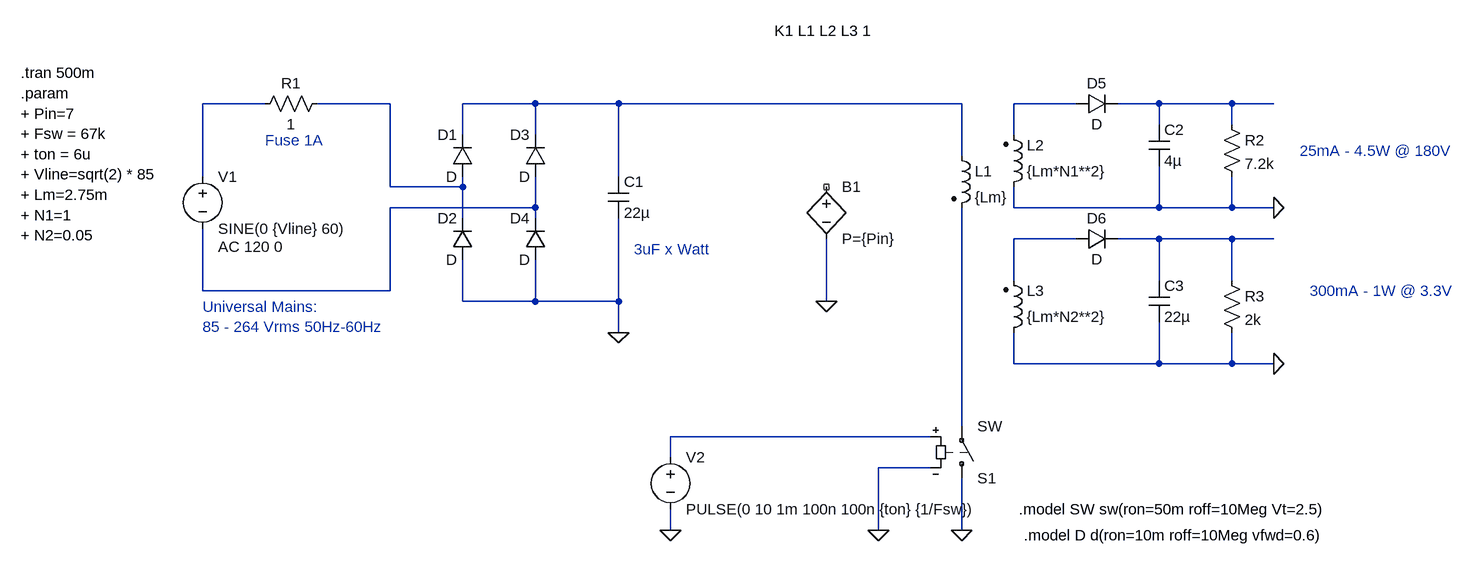
[diagram p0: schematic nixie_ac_dc_power.asc]
nixie_ac_dc_power.asc, the LTspice schematic file:
Version 4
SHEET 1 2016 680
WIRE 176 0 80 0
WIRE 368 0 256 0
WIRE 592 0 480 0
WIRE 720 0 592 0
WIRE 1248 0 720 0
WIRE 1424 0 1328 0
WIRE 1552 0 1488 0
WIRE 1664 0 1552 0
WIRE 1728 0 1664 0
WIRE 1552 32 1552 0
WIRE 1664 32 1664 0
WIRE 480 48 480 0
WIRE 592 48 592 0
WIRE 1328 48 1328 0
WIRE 1248 80 1248 0
WIRE 80 112 80 0
WIRE 720 112 720 0
WIRE 368 128 368 0
WIRE 480 128 480 112
WIRE 480 128 368 128
WIRE 592 160 592 112
WIRE 592 160 368 160
WIRE 1328 160 1328 128
WIRE 1552 160 1552 96
WIRE 1552 160 1328 160
WIRE 1664 160 1664 112
WIRE 1664 160 1552 160
WIRE 1728 160 1664 160
WIRE 480 176 480 128
WIRE 592 176 592 160
WIRE 1424 208 1328 208
WIRE 1552 208 1488 208
WIRE 1664 208 1552 208
WIRE 1728 208 1664 208
WIRE 1328 272 1328 208
WIRE 1552 272 1552 208
WIRE 1664 272 1664 208
WIRE 80 288 80 192
WIRE 368 288 368 160
WIRE 368 288 80 288
WIRE 480 304 480 240
WIRE 592 304 592 240
WIRE 592 304 480 304
WIRE 720 304 720 176
WIRE 720 304 592 304
WIRE 1040 304 1040 208
WIRE 720 352 720 304
WIRE 1328 400 1328 352
WIRE 1552 400 1552 336
WIRE 1552 400 1328 400
WIRE 1664 400 1664 352
WIRE 1664 400 1552 400
WIRE 1728 400 1664 400
WIRE 1248 496 1248 160
WIRE 1200 512 800 512
WIRE 800 544 800 512
WIRE 1200 560 1120 560
WIRE 800 656 800 624
WIRE 1120 656 1120 560
WIRE 1248 656 1248 576
FLAG 720 352 0
FLAG 1040 304 0
FLAG 1248 656 0
FLAG 1120 656 0
FLAG 800 656 0
FLAG 1728 400 0
FLAG 1728 160 0
SYMBOL voltage 80 96 R0
WINDOW 123 24 124 Left 2
WINDOW 39 0 0 Left 0
SYMATTR Value2 AC 120 0
SYMATTR InstName V1
SYMATTR Value SINE(0 {Vline} 60)
SYMBOL diode 496 112 R180
WINDOW 0 24 64 Left 2
WINDOW 3 24 0 Left 2
SYMATTR InstName D1
SYMBOL diode 496 240 R180
WINDOW 0 24 64 Left 2
WINDOW 3 24 0 Left 2
SYMATTR InstName D2
SYMBOL diode 608 112 R180
WINDOW 0 24 64 Left 2
WINDOW 3 24 0 Left 2
SYMATTR InstName D3
SYMBOL diode 608 240 R180
WINDOW 0 24 64 Left 2
WINDOW 3 24 0 Left 2
SYMATTR InstName D4
SYMBOL cap 704 112 R0
SYMATTR InstName C1
SYMATTR Value 22µ
SYMATTR SpiceLine Rser=10m
SYMBOL bv 1040 112 R0
SYMATTR InstName B1
SYMATTR Value P={Pin}
SYMBOL res 272 -16 R90
WINDOW 0 0 56 VBottom 2
WINDOW 3 32 56 VTop 2
SYMATTR InstName R1
SYMATTR Value 1
SYMBOL ind2 1232 64 R0
SYMATTR InstName L1
SYMATTR Value {Lm}
SYMATTR Type ind
SYMBOL ind2 1312 144 M180
WINDOW 0 36 80 Left 2
WINDOW 3 36 40 Left 2
SYMATTR InstName L2
SYMATTR Value {Lm*N1**2}
SYMATTR Type ind
SYMBOL ind2 1312 368 M180
WINDOW 0 36 80 Left 2
WINDOW 3 36 40 Left 2
SYMATTR InstName L3
SYMATTR Value {Lm*N2**2}
SYMATTR Type ind
SYMBOL diode 1424 16 R270
WINDOW 0 32 32 VTop 2
WINDOW 3 0 32 VBottom 2
SYMATTR InstName D5
SYMBOL diode 1424 224 R270
WINDOW 0 32 32 VTop 2
WINDOW 3 0 32 VBottom 2
SYMATTR InstName D6
SYMBOL cap 1536 32 R0
SYMATTR InstName C2
SYMATTR Value 4µ
SYMATTR SpiceLine Rser=10m
SYMBOL cap 1536 272 R0
SYMATTR InstName C3
SYMATTR Value 22µ
SYMATTR SpiceLine Rser=10m
SYMBOL sw 1248 592 M180
SYMATTR InstName S1
SYMBOL voltage 800 528 R0
WINDOW 123 0 0 Left 0
WINDOW 39 0 0 Left 0
SYMATTR InstName V2
SYMATTR Value PULSE(0 10 1m 100n 100n {ton} {1/Fsw})
SYMBOL res 1648 16 R0
SYMATTR InstName R2
SYMATTR Value 7.2k
SYMBOL res 1648 256 R0
SYMATTR InstName R3
SYMATTR Value 2k
TEXT -200 -48 Left 2 !.tran 500m
TEXT -200 -16 Left 2 !.param \n+ Pin=7 \n+ Fsw = 67k\n+ ton = 6u\n+ Vline=sqrt(2) * 85\n+ Lm=2.75m\n+ N1=1 \n+ N2=0.05
TEXT 80 312 Left 2 ;Universal Mains: \n85 - 264 Vrms 50Hz-60Hz
TEXT 176 56 Left 2 ;Fuse 1A
TEXT 960 -112 Left 2 !K1 L1 L2 L3 1
TEXT 1336 624 Left 2 !.model SW sw(ron=50m roff=10Meg Vt=2.5)
TEXT 1344 664 Left 2 !.model D d(ron=10m roff=10Meg vfwd=0.6)
TEXT 744 224 Left 2 ;3uF x Watt
TEXT 1768 72 Left 2 ;25mA - 4.5W @ 180V
TEXT 1784 288 Left 2 ;300mA - 1W @ 3.3V

The netlist it stands for:
* nixie_ac_dc_power.asc
V1 N001 N006 SINE(0 {Vline} 60) AC 120 0
D1 N002 N003 D
D2 0 N002 D
D3 N006 N003 D
D4 0 N006 D
C1 N003 0 22µ Rser=10m
B1 NC_01 0 P={Pin}
R1 N002 N001 1
L1 N003 N009 {Lm}
L2 0 N004 {Lm*N1**2}
L3 0 N007 {Lm*N2**2}
D5 N004 N005 D
D6 N007 N008 D
C2 N005 0 4µ Rser=10m
C3 N008 0 22µ Rser=10m
S1 0 N009 N010 0 SW
V2 N010 0 PULSE(0 10 1m 100n 100n {ton} {1/Fsw})
R2 N005 0 7.2k
R3 N008 0 2k
.model D D
.lib standard.dio
.tran 500m
.param
+ Pin=7
+ Fsw = 67k
+ ton = 6u
+ Vline=sqrt(2) * 85
+ Lm=2.75m
+ N1=1
+ N2=0.05
* Universal Mains:
* 85 - 264 Vrms 50Hz-60Hz
* Fuse 1A
K1 L1 L2 L3 1
.model SW sw(ron=50m roff=10Meg Vt=2.5)
.model D d(ron=10m roff=10Meg vfwd=0.6)
* 3uF x Watt
* 25mA - 4.5W @ 180V
* 300mA - 1W @ 3.3V
.backanno
.end